# Altium schematic sheet out_drv.SchDoc: =ProjectName+'_'+ProjectRevision+'_'+VariantName
size A3; DocumentNumber: 5; SheetNumber: 5; SheetTotal: 5
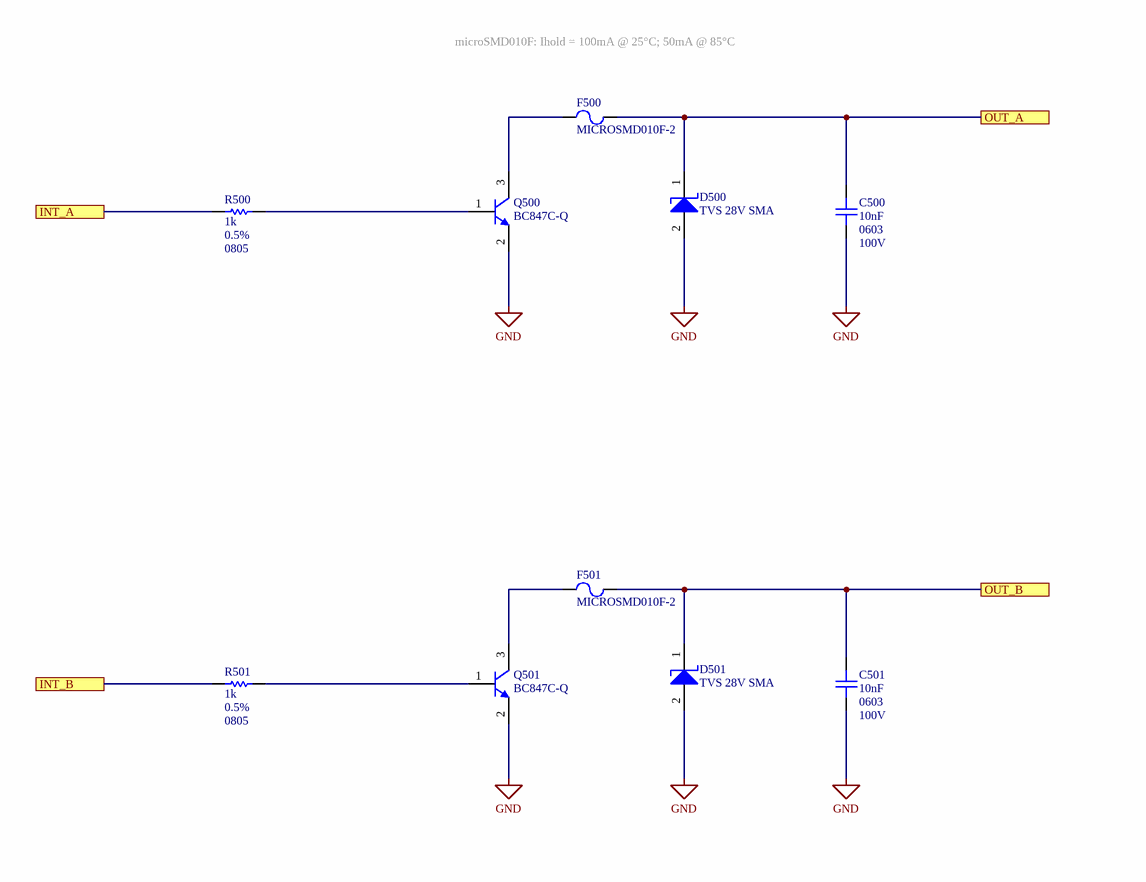
[diagram p0: out_drv.SchDoc, left]

## Parts
C500  Case/Package: 0603  Op Voltage: 100V  [CER0603]  (hidden comment: 10nF)
C501  Case/Package: 0603  Op Voltage: 100V  [CER0603]  (hidden comment: 10nF)
D500  value TVS 28V SMA  [DO-214AC_SMA]  (hidden comment: SMD/PTH TVS Unidirectional Diode)
D501  value TVS 28V SMA  [DO-214AC_SMA]  (hidden comment: SMD/PTH TVS Unidirectional Diode)
F500  value MICROSMD010F-2  [PTCC3226X08N]  (hidden comment: Fuse_PTCRes)
F501  value MICROSMD010F-2  [PTCC3226X08N]  (hidden comment: Fuse_PTCRes)
Q500  value BC847C-Q  [SOT95P230X110-3N]  (hidden comment: NPN Transistor SMD)
Q501  value BC847C-Q  [SOT95P230X110-3N]  (hidden comment: NPN Transistor SMD)
R500  value 1k  Tolerance: 0.5%  Case/Package: 0805  [Res0603]  (hidden comment: SMD Resistor)
R501  value 1k  Tolerance: 0.5%  Case/Package: 0805  [Res0603]  (hidden comment: SMD Resistor)

## Ports
INT_A, INT_B, OUT_A, OUT_B

## Nets
GND: C500.2 C501.2 D500.2(A) D501.2(A) Q500.2(E) Q501.2(E)
INT_A: R500.1 ; port INT_A
INT_B: R501.1 ; port INT_B
OUT_A: C500.1 D500.1(K) F500.2 ; port OUT_A
OUT_B: C501.1 D501.1(K) F501.2 ; port OUT_B
NetF500_1: F500.1 Q500.3(C)
NetF501_1: F501.1 Q501.3(C)
NetQ500_1: Q500.1(B) R500.2
NetQ501_1: Q501.1(B) R501.2

## Notes on the sheet
- microSMD010F: Ihold = 100mA @ 25°C; 50mA @ 85°C
- Proj
- Title:
- Approved:
- Sheet
- File Name:
- Rev:
- Author:
- Date:
- Size:
- A3
- Number:

## Library data of the parts
C500 C501 = GCM188R72A103KA37: MLCC Automotive, 10nF, 0603, 100V, 10%, X7R; MFG1: MURATA; Min Op# Temp °C: -55; Max Op# temp °C: 125; Qualification: AEC-Q200; MPN1: GCM188R72A103KA37; Value: 10nF; Tolerance: 10%; Dielectric: X7R; Supplier: Mouser; Supplier Part Number: 81-GCM188R72A103KA7D; Supplier URL: https://www.mouser.it/ProductDetail/Murata-Electronics/GCM188R72A103KA37D?qs=aEuGZpxfbxXMjTExujWHsg%3D%3D; Datasheet URL: https://www.mouser.it/datasheet/2/281/1/GCM188R72A103KA37_01C-3144519.pdf; Technology: Powertrain/Safety for Automotive
D500 D501 = SMA6T28AY: TVS Uniir 28V SMA; MFG1: ST; 10/1000us Power: 0.6Kw; 8/20us Power: 4KW; Stand-Off Voltage: 24V; Min Op# Temp °C: -55; Max Op# temp °C: 150; Qualification: AEC-Q101; MPN1: SMA6T28AY; Case/Package: SMA/DO-214AC; Type: Unidirectional; Supplier: Mouser; Supplier Part Number: 511-SMA6T28AY; Supplier URL: https://www.mouser.it/ProductDetail/STMicroelectronics/SMAJ30A-TR?qs=zr%2F4QzOm779pW41kykOibw%3D%3D; Datasheet URL: https://www.mouser.it/datasheet/2/389/sma6ty-1850088.pdf
F500 F501 = MICROSMD010F-2: Resettable Fuse PPTC, 100mA Hold, 250mA Trip, 2.1R min, 30V; MFG1: LITTLEFUSE; Max Resistance: 2.1; Min Op# Temp °C: -40; Max Op# temp °C: 85°; Manufacturer: *; PN: *; Voltage: *; Current: *; MPN1: MICROSMD010F-2; Hold Current: 100mA; Case/Package: 1210; Trip Current: 250mA; Supplier: Mouser; Supplier Part Number: 650-MICROSMD010F-2; Supplier URL: https://www.mouser.it/it/ProductDetail/Littelfuse/MICROSMD010F-2?qs=RMiEzKrVl1c3GmCbTUJbRQ%3D%3D; Datasheet URL: https://www.littelfuse.com/assetdocs/littelfuse-ptc-microsmd-datasheet?assetguid=9831a125-bc6a-4727-872e-aa92d8395030; Technology: SMD
Q500 Q501 = NEXPERIA: NPN general purpose transistors; MPN1: BC847C-QR; Vce Max (V): 45; Ic (mA): 100; Hfe (min): 520; Power Diss (mW): 250; Min Op# Temp °C: -65; Max Op# temp °C: 150; Qualification: AEC-Q101; Manufacturer: *; PN: *; MFG1: NEXPERIA; MFG2: Diodes; MPN2: BC847C-Q; Case/Package: SOT23-3; Type: NPN; Supplier: Mouser; Supplier Part Number: 771-BC847C-QR; Supplier URL: https://www.mouser.it/ProductDetail/Nexperia/BC847C-QR?qs=e8oIoAS2J1RqA3Lgar2wrA%3D%3D; Manufacturer URL: https://www.nexperia.com/search?q=BC847C-Q&searchCategory=
R500 R501 = ERJ-UP6D1001V: Thick Film SM Chip Resistors, 1K, 0805, ±0.5%, 1/2W; MFG1: PANASONIC; Power: 500mW; Temp# Coeffiient (PPM/C): 100; Min Op# Temp °C: -55; Max Op# temp °C: 155; Qualification: AEC-Q200; MPN1: ERJ-UP6D1001V; Supplier: Mouser; Supplier Part Number: 667-ERJ-UP6D1001V; Supplier URL: https://www.mouser.it/ProductDetail/Panasonic/ERJ-UP6D1001V?qs=sGAEpiMZZMvdGkrng054t2cqbZCzJY7NErLgAwiDoTXwln0CjOTO8w%3D%3D; Datasheet URL: https://www.mouser.com/catalog/specsheets/Panasonic_03-31-2024_Resistor_Anti-Sulfur(ERJ-UP6D-Series).pdf?_gl=1*1e8nwi8*_gcl_aw*R0NMLjE3Njc5NTQ2NTkuQ2p3S0NBaUE2NExMQmhCaEVpd0EtUHhndXhkNEYtbVB4TUc1OThEMlhWWVZvVEZGVXVGM1djYmUtdlk1a3VMZFRfZGNHclBMelhFSjRSb0NH; Technology: Thick Film